# EAGLE schematic PCB-ARD-DUEBOS (EAGLE 6.5.0)
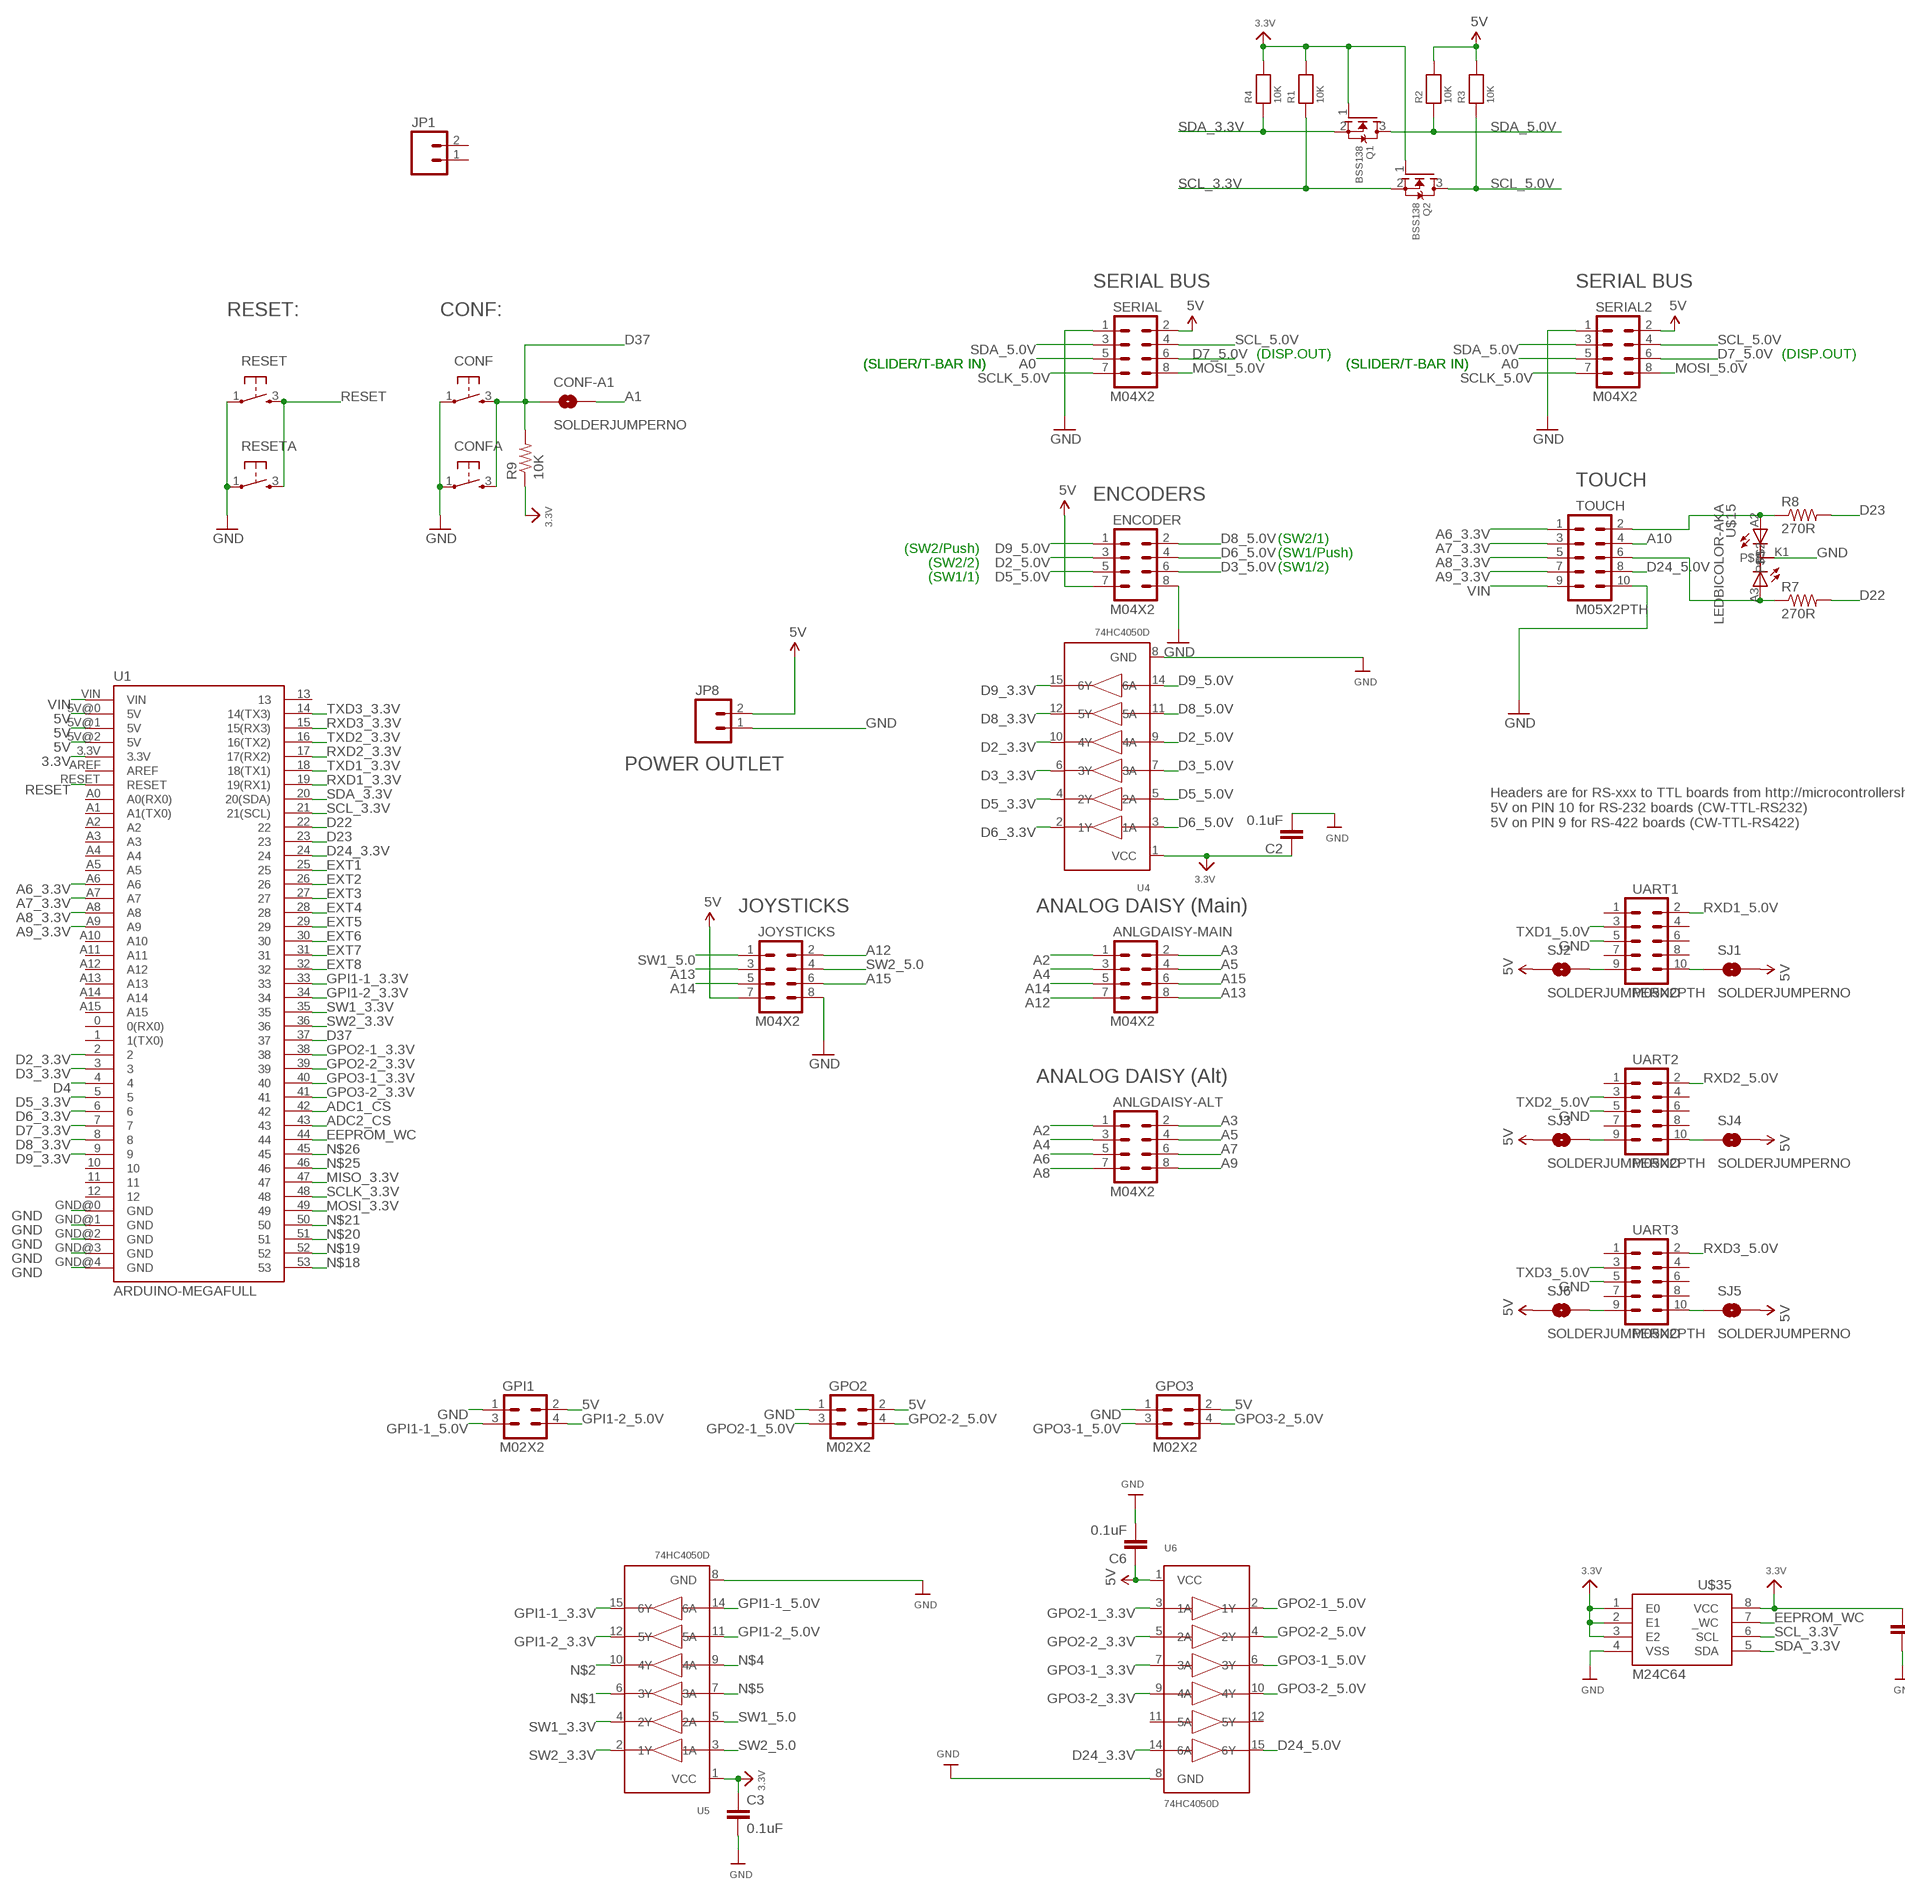
[diagram p0: schematic, sheet 1, part 1 of 2]
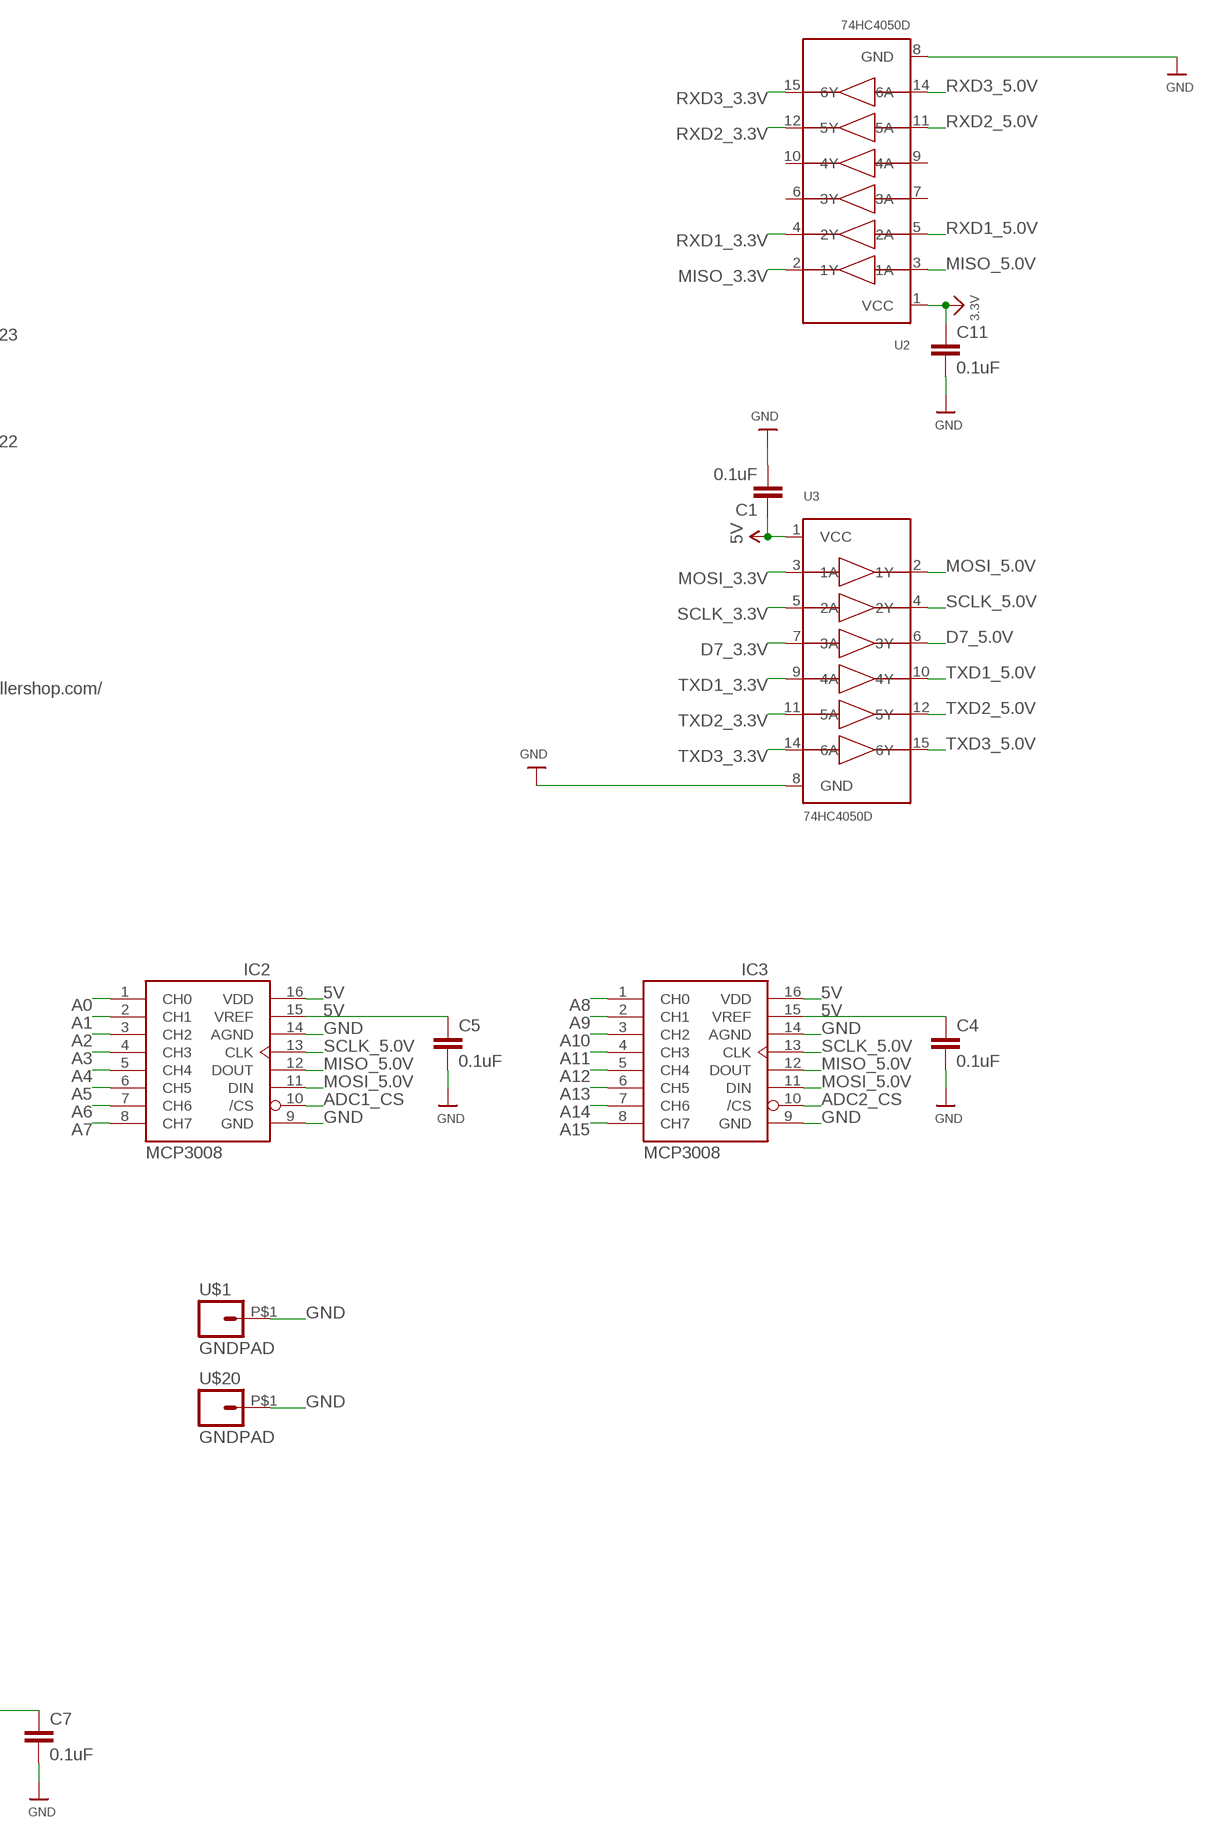
[diagram p1: schematic, sheet 1, part 2 of 2]

## Parts
ANLGDAISY-ALT  M04X2  [2X4]
ANLGDAISY-MAIN  M04X2  [2X4]
C1  0.1uF  CAP0603-CAP  [0603-CAP]
C2  0.1uF  CAP0603-CAP  [0603-CAP]
C3  0.1uF  CAP0603-CAP  [0603-CAP]
C4  0.1uF  CAP0603-CAP  [0603-CAP]
C5  0.1uF  CAP0603-CAP  [0603-CAP]
C6  0.1uF  CAP0603-CAP  [0603-CAP]
C7  0.1uF  CAP0603-CAP  [0603-CAP]
C11  0.1uF  CAP0603-CAP  [0603-CAP]
CONF  TAC_SWITCH  [PUSHBUTTON]
CONF-A1  SOLDERJUMPERNO  [SJ_2S-NO]
CONFA  TAC_SWITCH  [PUSHBUTTON]
ENCODER  M04X2  [2X4]
GPI1  M02X2  [2X2]
GPO2  M02X2  [2X2]
GPO3  M02X2  [2X2]
IC2  MCP3008SOIC  [SOIC16]
IC3  MCP3008SOIC  [SOIC16]
JOYSTICKS  M04X2  [2X4]
JP1  M02PTH  [1X02]
JP8  M02PTH4  [1X02_XTRA_BIG]
Q1  BSS138  MOSFET-NWIDE  [SOT23-WIDE]
Q2  BSS138  MOSFET-NWIDE  [SOT23-WIDE]
R1  10K  RESISTOR0805  [0805]
R2  10K  RESISTOR0805  [0805]
R3  10K  RESISTOR0805  [0805]
R4  10K  RESISTOR0805  [0805]
R7  270R  RESISTOR0603-RES  [0603-RES]
R8  270R  RESISTOR0603-RES  [0603-RES]
R9  10K  RESISTOR0603-RES  [0603-RES]
RESET  TAC_SWITCH  [PUSHBUTTON]
RESETA  TAC_SWITCH  [PUSHBUTTON]
SERIAL  M04X2  [2X4]
SERIAL2  M04X2  [2X4]
SJ1  SOLDERJUMPERNO  [SJ_2S-NO]
SJ2  SOLDERJUMPERNO  [SJ_2S-NO]
SJ3  SOLDERJUMPERNO  [SJ_2S-NO]
SJ4  SOLDERJUMPERNO  [SJ_2S-NO]
SJ5  SOLDERJUMPERNO  [SJ_2S-NO]
SJ6  SOLDERJUMPERNO  [SJ_2S-NO]
TOUCH  M05X2PTH  [AVR_ICSP]
U1  ARDUINO-MEGAFULL  [ARDUINO_MEGA]
U2  74HC4050D  74HC4050DTSSOP16  [TSSOP16]
U3  74HC4050D  74HC4050DTSSOP16  [TSSOP16]
U4  74HC4050D  74HC4050DTSSOP16  [TSSOP16]
U5  74HC4050D  74HC4050DTSSOP16  [TSSOP16]
U6  74HC4050D  74HC4050DTSSOP16  [TSSOP16]
U$1  GNDPAD  [3.2MMPAD]
U$15  LEDBICOLOR-AKA  [LED5MM-BICOLOR]
U$20  GNDPAD  [3.2MMPAD]
U$35  M24C64  [TSSOP8]
UART1  M05X2PTH  [AVR_ICSP]
UART2  M05X2PTH  [AVR_ICSP]
UART3  M05X2PTH  [AVR_ICSP]

## Nets
3.3V [Power]: C2.1 C3.1 C7.1 C11.1 Q1.1(G) Q2.1(G) R1.2 R4.2 R9.1 U1.3.3V U2.1(VCC) U4.1(VCC) U5.1(VCC) U$35.1(E0) U$35.2(E1) U$35.3(E2) U$35.8(VCC)
5V [Power]: C1.1 C4.1 C5.1 C6.1 ENCODER.7 GPI1.2 GPO2.2 GPO3.2 IC2.15(VREF) IC2.16(VDD) IC3.15(VREF) IC3.16(VDD) JOYSTICKS.7 JP8.2 R2.2 R3.2 SERIAL2.2 SERIAL.2 SJ1.2 SJ2.1 SJ3.1 SJ4.2 SJ5.2 SJ6.1 U1.5V@0(5V) U1.5V@1(5V) U1.5V@2(5V) U3.1(VCC) U6.1(VCC)
A0: IC2.1(CH0) SERIAL2.5 SERIAL.5
A1: CONF-A1.2 IC2.2(CH1)
A2: ANLGDAISY-ALT.1 ANLGDAISY-MAIN.1 IC2.3(CH2)
A3: ANLGDAISY-ALT.2 ANLGDAISY-MAIN.2 IC2.4(CH3)
A4: ANLGDAISY-ALT.3 ANLGDAISY-MAIN.3 IC2.5(CH4)
A5: ANLGDAISY-ALT.4 ANLGDAISY-MAIN.4 IC2.6(CH5)
A6: ANLGDAISY-ALT.5 IC2.7(CH6)
A6_3.3V: TOUCH.1 U1.A6
A7: ANLGDAISY-ALT.6 IC2.8(CH7)
A7_3.3V: TOUCH.3 U1.A7
A8: ANLGDAISY-ALT.7 IC3.1(CH0)
A8_3.3V: TOUCH.5 U1.A8
A9: ANLGDAISY-ALT.8 IC3.2(CH1)
A9_3.3V: TOUCH.7 U1.A9
A10: IC3.3(CH2) TOUCH.4
A11: IC3.4(CH3)
A12: ANLGDAISY-MAIN.7 IC3.5(CH4) JOYSTICKS.2
A13: ANLGDAISY-MAIN.8 IC3.6(CH5) JOYSTICKS.3
A14: ANLGDAISY-MAIN.5 IC3.7(CH6) JOYSTICKS.5
A15: ANLGDAISY-MAIN.6 IC3.8(CH7) JOYSTICKS.6
ADC1_CS: IC2.10(/CS) U1.42
ADC2_CS: IC3.10(/CS) U1.43
D2_3.3V: U1.2 U4.10(4Y)
D2_5.0V: ENCODER.3 U4.9(4A)
D3_3.3V: U1.3 U4.6(3Y)
D3_5.0V: ENCODER.6 U4.7(3A)
D4: U1.4
D5_3.3V: U1.5 U4.4(2Y)
D5_5.0V: ENCODER.5 U4.5(2A)
D6_3.3V: U1.6 U4.2(1Y)
D6_5.0V: ENCODER.4 U4.3(1A)
D7_3.3V: U1.7 U3.7(3A)
D7_5.0V: SERIAL2.6 SERIAL.6 U3.6(3Y)
D8_3.3V: U1.8 U4.12(5Y)
D8_5.0V: ENCODER.2 U4.11(5A)
D9_3.3V: U1.9 U4.15(6Y)
D9_5.0V: ENCODER.1 U4.14(6A)
D22: R7.2 U1.22
D23: R8.2 U1.23
D24_3.3V: U1.24 U6.14(6A)
D24_5.0V: TOUCH.8 U6.15(6Y)
D37: CONF-A1.1 CONF.3 CONFA.3 R9.2 U1.37
EEPROM_WC: U1.44 U$35.7(_WC)
EXT1: U1.25
EXT2: U1.26
EXT3: U1.27
EXT4: U1.28
EXT5: U1.29
EXT6: U1.30
EXT7: U1.31
EXT8: U1.32
GND [Power]: C1.2 C2.2 C3.2 C4.2 C5.2 C6.2 C7.2 C11.2 CONF.1 CONFA.1 ENCODER.8 GPI1.1 GPO2.1 GPO3.1 IC2.9(GND) IC2.14(AGND) IC3.9(GND) IC3.14(AGND) JOYSTICKS.8 JP8.1 RESET.1 RESETA.1 SERIAL2.1 SERIAL.1 TOUCH.10 U1.GND@0(GND) U1.GND@1(GND) U1.GND@2(GND) U1.GND@3(GND) U1.GND@4(GND) U2.8(GND) U3.8(GND) U4.8(GND) U5.8(GND) U6.8(GND) U$1.P$1 U$15.K1 U$20.P$1 U$35.4(VSS) UART1.5 UART2.5 UART3.5
GPI1-1_3.3V: U1.33 U5.15(6Y)
GPI1-1_5.0V: GPI1.3 U5.14(6A)
GPI1-2_3.3V: U1.34 U5.12(5Y)
GPI1-2_5.0V: GPI1.4 U5.11(5A)
GPO2-1_3.3V: U1.38 U6.3(1A)
GPO2-1_5.0V: GPO2.3 U6.2(1Y)
GPO2-2_3.3V: U1.39 U6.5(2A)
GPO2-2_5.0V: GPO2.4 U6.4(2Y)
GPO3-1_3.3V: U1.40 U6.7(3A)
GPO3-1_5.0V: GPO3.3 U6.6(3Y)
GPO3-2_3.3V: U1.41 U6.9(4A)
GPO3-2_5.0V: GPO3.4 U6.10(4Y)
MISO_3.3V: U1.47 U2.2(1Y)
MISO_5.0V: IC2.12(DOUT) IC3.12(DOUT) U2.3(1A)
MOSI_3.3V: U1.49 U3.3(1A)
MOSI_5.0V: IC2.11(DIN) IC3.11(DIN) SERIAL2.8 SERIAL.8 U3.2(1Y)
N$1: U5.6(3Y)
N$2: U5.10(4Y)
N$3: SJ6.2 UART3.9
N$4: U5.9(4A)
N$5: U5.7(3A)
N$6: SJ3.2 UART2.9
N$9: SJ2.2 UART1.9
N$10: SJ1.1 UART1.10
N$12: SJ4.1 UART2.10
N$13: SJ5.1 UART3.10
N$17: R8.1 TOUCH.2 U$15.A2
N$18: U1.53
N$19: U1.52
N$20: U1.51
N$21: U1.50
N$22: R7.1 TOUCH.6 U$15.A3
N$25: U1.46
N$26: U1.45
RESET: RESET.3 RESETA.3 U1.RESET
RXD1_3.3V: U1.19(19(RX1)) U2.4(2Y)
RXD1_5.0V: U2.5(2A) UART1.2
RXD2_3.3V: U1.17(17(RX2)) U2.12(5Y)
RXD2_5.0V: U2.11(5A) UART2.2
RXD3_3.3V: U1.15(15(RX3)) U2.15(6Y)
RXD3_5.0V: U2.14(6A) UART3.2
SCL_3.3V: Q2.2(S) R1.1 U1.21(21(SCL)) U$35.6(SCL)
SCL_5.0V: Q2.3(D) R3.1 SERIAL2.4 SERIAL.4
SCLK_3.3V: U1.48 U3.5(2A)
SCLK_5.0V: IC2.13(CLK) IC3.13(CLK) SERIAL2.7 SERIAL.7 U3.4(2Y)
SDA_3.3V: Q1.2(S) R4.1 U1.20(20(SDA)) U$35.5(SDA)
SDA_5.0V: Q1.3(D) R2.1 SERIAL2.3 SERIAL.3
SW1_3.3V: U1.35 U5.4(2Y)
SW1_5.0: JOYSTICKS.1 U5.5(2A)
SW2_3.3V: U1.36 U5.2(1Y)
SW2_5.0: JOYSTICKS.4 U5.3(1A)
TXD1_3.3V: U1.18(18(TX1)) U3.9(4A)
TXD1_5.0V: U3.10(4Y) UART1.3
TXD2_3.3V: U1.16(16(TX2)) U3.11(5A)
TXD2_5.0V: U3.12(5Y) UART2.3
TXD3_3.3V: U1.14(14(TX3)) U3.14(6A)
TXD3_5.0V: U3.15(6Y) UART3.3
VIN [Power]: TOUCH.9 U1.VIN
Unconnected: JP1.1 JP1.2 U1.0(0(RX0)) U1.1(1(TX0)) U1.10 U1.11 U1.12 U1.13 U1.A0(A0(RX0)) U1.A1(A1(TX0)) U1.A2 U1.A3 U1.A4 U1.A5 U1.A10 U1.A11 U1.A12 U1.A13 U1.A14 U1.A15 U1.AREF U2.6(3Y) U2.7(3A) U2.9(4A) U2.10(4Y) U6.11(5A) U6.12(5Y) UART1.1 UART1.4 UART1.6 UART1.7 UART1.8 UART2.1 UART2.4 UART2.6 UART2.7 UART2.8 UART3.1 UART3.4 UART3.6 UART3.7 UART3.8

## Notes on the sheet
- SERIAL BUS | SERIAL BUS
- RESET: | CONF:
- (DISP.OUT) | (DISP.OUT)
- (SLIDER/T-BAR IN) | (SLIDER/T-BAR IN) | (SLIDER/T-BAR IN) | (SLIDER/T-BAR IN)
- TOUCH
- ENCODERS
- (SW2/Push) | (SW2/1)
- (SW2/2) | (SW1/Push)
- (SW1/1) | (SW1/2)
- POWER OUTLET
- Headers are for RS-xxx to TTL boards from http://microcontrollershop.com/
  5V on PIN 10 for RS-232 boards (CW-TTL-RS232)
  5V on PIN 9 for RS-422 boards (CW-TTL-RS422)
- JOYSTICKS | ANALOG DAISY (Main)
- ANALOG DAISY (Alt)

## Library data of the parts
ANLGDAISY-ALT ANLGDAISY-MAIN ENCODER JOYSTICKS SERIAL SERIAL2 = SparkFun:M04X2
C1-C7 C11 = SparkFun:CAP: Capacitor Standard 0603 ceramic capacitor, and 0.1" leaded capacitor.
CONF CONFA RESET RESETA = SKAARHOJ:TAC_SWITCH: Momentary Switch Button commonly used for reset or general input. Spark Fun Electronics SKU : COM-00097
CONF-A1 SJ1-SJ6 = SparkFun:SOLDERJUMPER: Solder Jumper Standard SMD solder jumper. Used to automate production. Two varients : Normally Open and Normally Closed are the same, but have different paste layers. NC will have a large amount of paste and should jumper during reflow.
GPI1 GPO2 GPO3 = SKAARHOJ:M02X2
IC2 IC3 = SKAARHOJ:MCP3008
JP1 JP8 = SparkFun:M02: Header 2 Standard 2-pin 0.1" header. Use with straight break away headers (SKU : PRT-00116), right angle break away headers (PRT-00553), swiss pins (PRT-00743), machine pins (PRT-00117), and female headers (PRT-00115). Molex polarized connector foot print use with SKU : PRT-08233 with associated crimp pins and housings.
Q1 Q2 = microbuilder:MOSFET-N: N-Channel Mosfet LEGEND VDS: Voltage Drain-Source ID: Drain Current RDS(ON): Drain-Source On-State Resistance VGS(TH): Gate-Source Threshold Voltage CISS: Drain-Source Input Capacitance SOT-23 Name VDS ID RDS(ON) VGS(TH) CISS Order Number 2N7002E 60V 260mA 2.5 Ohm 2.5V @ 250uA 26.7pF @ 25V 2N7002ET1GOSTR-ND BSH103 30V 850mA 400 mOhm 400mV @ 1mA 83pF @ 24V BSH103,235-ND BSS138 60V 320mA 1.6 Ohm 1.5V @ 250uA 50pF @ 10V Mouser: 771-BSS138PW115 DMN2075U-7 20V 4.2A 38 mOhm 1V @ 250 uA 594.3pF @ 10V DMN2075U-7DICT-ND * BSS138 good choice for I2C level-shifting
R1-R4 = microbuilder:RESISTOR: Resistors 0402 - 0402 Surface Mount Package 22 Ohm 1% 1/16W [Digikey: 311-22.0LRTR-ND] 33 Ohm 5% 1/16W 1.0K 5% 1/16W 1.5K 5% 1/16W 2.0K 1% 1/16W 10.0K 1% 1/16W [Digikey: 311-10.0KLRTR-ND] 10.0K 5% 1/16W [Digikey: RMCF0402JT10K0TR-ND] 12.1K 1% 1/16W [Digikey: 311-22.0LRTR-ND] 100.0K 5% 1/16W 0603 - 0603 Surface Mount Package 0 Ohm 1/10 Watt 1% Resistor 15 Ohm 1/10 Watt 1% Resistor 33 Ohm 1/10 Watt 1% Resistor 49.9 Ohm 1/10 Watt 1% Resistor 100 Ohm 1/10 Watt 1% Resistor 150 Ohm 1/10 Watt 1% Resistor 240 Ohm 1/10 Watt 1% Resistor 390 Ohm 1/10 Watt 1% Resistor 560 Ohm 1/10 Watt 1% Resistor 680 Ohm 1/10 Watt 1% Resistor 750 Ohm 1/10 Watt 1% Resistor 1.0K Ohm 1/10 Watt 1% Resistor 1.5K Ohm 1/10 Watt 1% Resistor 2.0K Ohm 1/10 Watt 1% Resistor 2.2K Ohm 1/10 Watt 1% Resistor 3.3K Ohm 1/10 Watt 1% Resistor 4.7K Ohm 1/10 Watt 1% Resistor 10.0K Ohm 1/10 Watt 1% Resistor 12.0K Ohm 1/10 Watt 1% Resistor 12.1K Ohm 1/10 Watt 1% Resistor 20.0K Ohm 1/10 Watt 1% Resistor 33.0K Ohm 1/10 Watt 1% Resistor 100.0K Ohm 1/10 Watt 1% Resistor 0805 - 0805 Surface Mount Package 0 Ohm 1/8 Watt 1% Resistor 33 Ohm 1/8 Watt 1% Resistor 100 Ohm 1/8 Watt 1% Resistor 150 Ohm 1/8 Watt 1% Resistor 200 Ohm 1/8 Watt 1% Resistor 240 Ohm 1/8 Watt 1% Resistor 330 Ohm 1/8 Watt 1% Resistor 390 Ohm 1/8 Watt 1% Resistor 470 Ohm 1/8 Watt 1% Resistor 1.0K Ohm 1/8 Watt 1% Resistor 1.5K Ohm 1/8 Watt 1% Resistor 2.0K Ohm 1/8 Watt 1% Resistor 4.7K Ohm 1/8 Watt 1% Resistor 5.1K Ohm 1/8 Watt 1% Resistor 5.6K Ohm 1/8 Watt 1% Resistor 10.0K Ohm 1/8 Watt 1% Resistor 22.0K Ohm 1/8 Watt 1% Resistor 33.0K Ohm 1/8 Watt 1% Resistor 100K Ohm 1/8 Watt 1% Resistor 1206 - 1206 Surface Mount Package 2012 - 2010 Surface Mount Package 0.11 Ohm 1/2 Watt 1% Resistor - Digikey: RHM.11UCT-ND
R7-R9 = SparkFun:RESISTOR: Resistor Basic schematic elements and footprints for 0603, 1206, and PTH resistors.
TOUCH UART1-UART3 = SparkFun:M05X2: Header 5x2 Standard 10-pin dual row 0.1" header. Commonly used with AVR-ISP. Use with Spark Fun Electronics SKU: PRT-00778
U1 = SKAARHOJ:ARDUINO-MEGA: Arduino Mega footprint connections
U2-U6 = SKAARHOJ:74HC4050D: 6-channel level shifter 74HC4050D - 2V-6V Supply Digikey: 74HC4050D,653-ND Mouser: 771-74HC4050D-T
U$1 U$20 = SKAARHOJ:GNDPAD
U$15 = SKAARHOJ:LEDBICOLOR-AKA
U$35 = SKAARHOJ:M24C64

## Net classes
0 default: width 0.203 mm, drill 0.61 mm, clearance 0.203 mm
1 Power: width 0.508 mm, drill 0.61 mm, clearance 0.305 mm
2 RELAY LINES: width 0.305 mm, clearance 0.203 mm
3 INput lines: clearance 0.203 mm